# EAGLE design SenseSing-prog-adaptor-v0.2 (EAGLE 6.4)
REVISION: V0.2
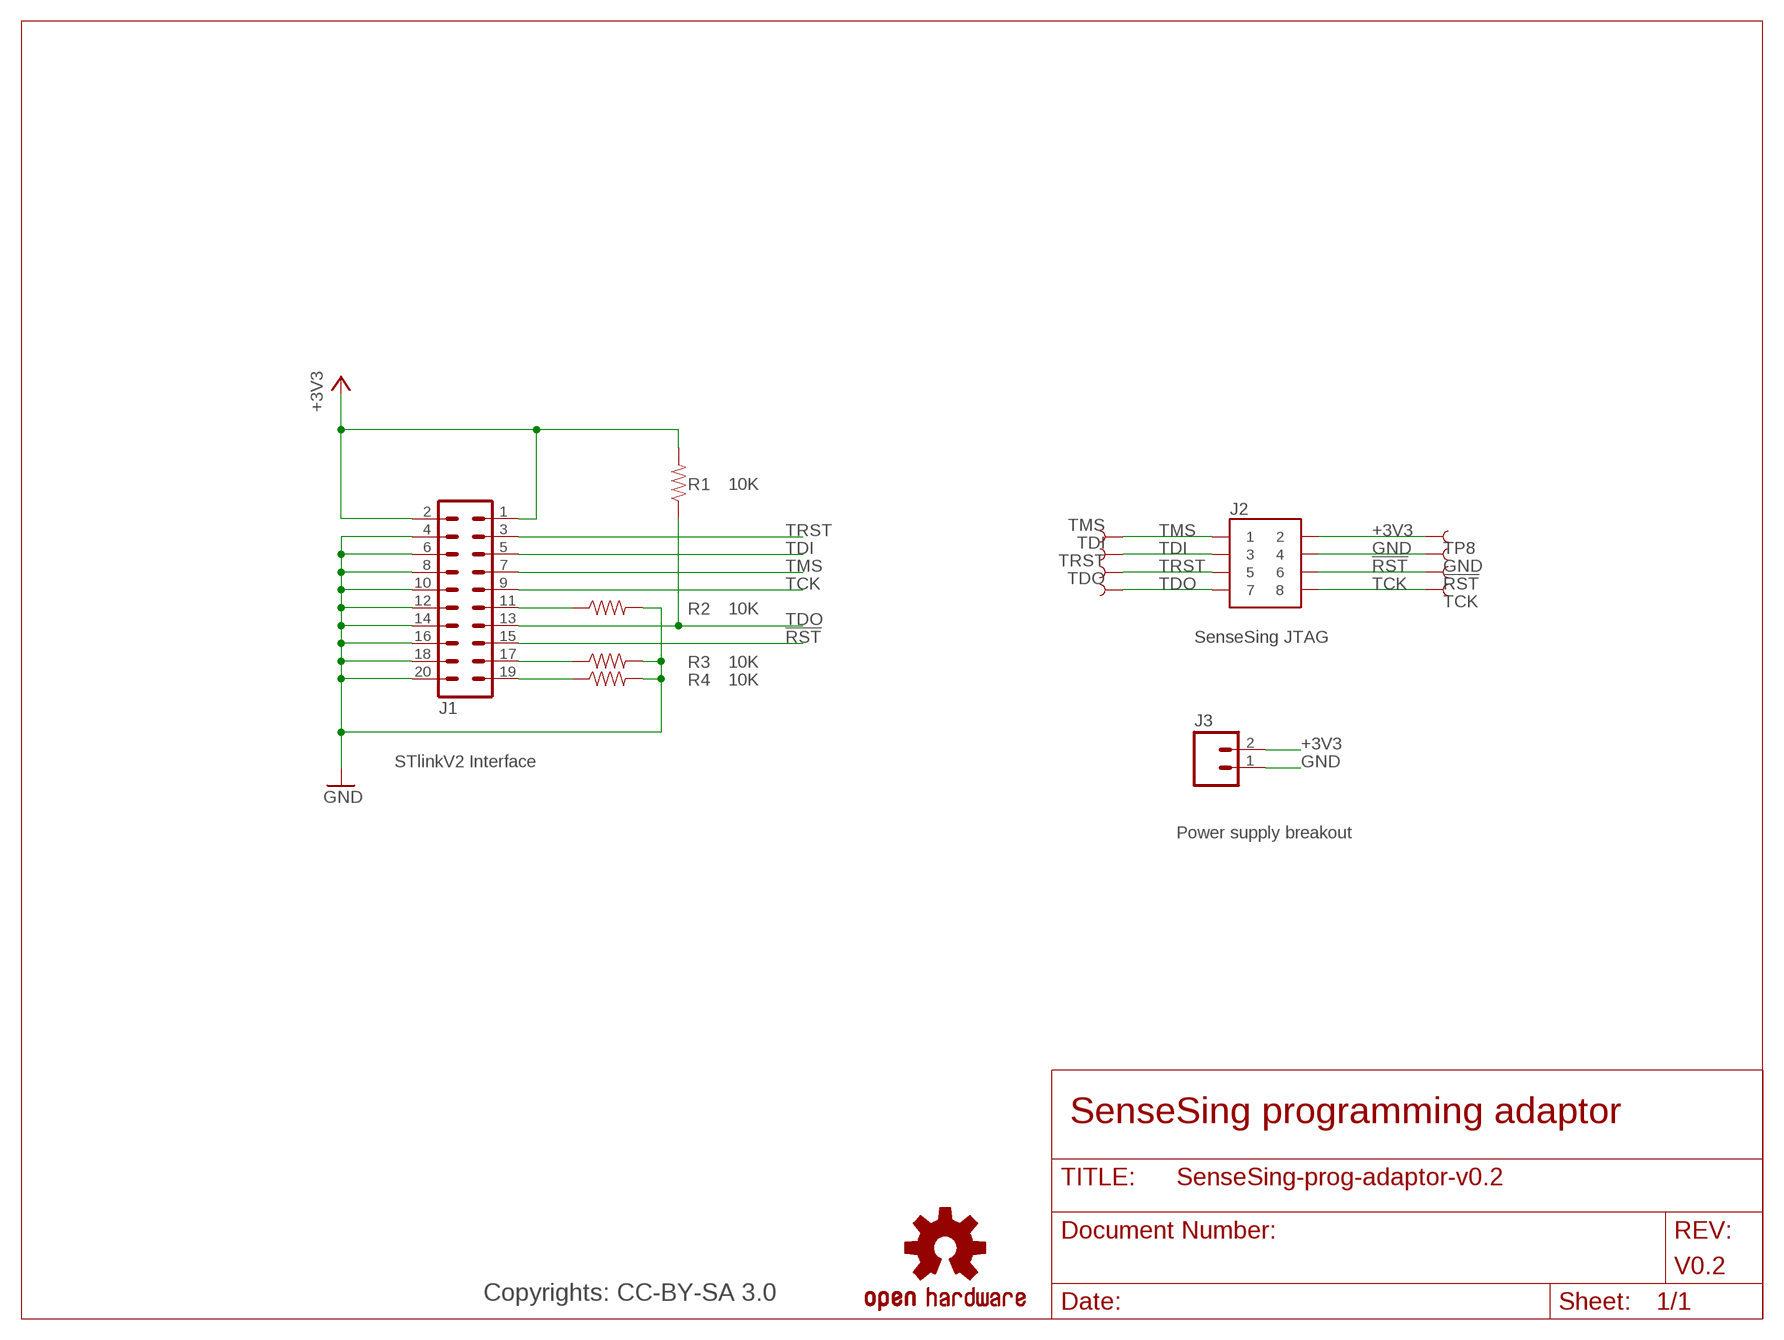
[diagram p0: schematic, sheet 1]

## Parts
!RST  TEST-POINT3  [PAD.03X.03]
GND  TEST-POINT3  [PAD.03X.03]
J1  ML20  [ML20]
J2  JTAG_CONNECTOR  [JTAG_DIP]
J3  M02PTH  [1X02]
LOGO1  OSHW-LOGOPAD  [OSHW-LOGO-M-PAD]
R1  10K  RESISTORAXIAL-0.3  [AXIAL-0.3]
R2  10K  RESISTORAXIAL-0.3  [AXIAL-0.3]
R3  10K  RESISTORAXIAL-0.3  [AXIAL-0.3]
R4  10K  RESISTORAXIAL-0.3  [AXIAL-0.3]
TCK  TEST-POINT3  [PAD.03X.03]
TDI  TEST-POINT3  [PAD.03X.03]
TDO  TEST-POINT3  [PAD.03X.03]
TMS  TEST-POINT3  [PAD.03X.03]
TP8  TEST-POINT3  [PAD.03X.03]
TRST  TEST-POINT3  [PAD.03X.03]

## Nets
!RST: !RST.P$1 J1.15 J2.6
+3V3: J1.1 J1.2 J2.2 J3.2 R1.P$2 TP8.P$1
GND: GND.P$1 J1.4 J1.6 J1.8 J1.10 J1.12 J1.14 J1.16 J1.18 J1.20 J2.4 J3.1 R2.P$2 R3.P$2 R4.P$2
N$13: J1.19 R4.P$1
N$14: J1.17 R3.P$1
N$15: J1.11 R2.P$1
TCK: J1.9 J2.8 TCK.P$1
TDI: J1.5 J2.3 TDI.P$1
TDO: J1.13 J2.7 R1.P$1 TDO.P$1
TMS: J1.7 J2.1 TMS.P$1
TRST: J1.3 J2.5 TRST.P$1

## Notes on the sheet
- SenseSing JTAG
- STlinkV2 Interface
- Power supply breakout
- SenseSing programming adaptor
- Copyrights: CC-BY-SA 3.0

## Library data of the parts
!RST GND TCK TDI TDO TMS TP8 TRST = SparkFun-Passives:TEST-POINT: Bare copper test points for troubleshooting or ICT
J1 = con-harting-ml:ML20: HARTING; OC_FARNELL: unknown; OC_NEWARK: unknown
J2 = JTAG Connector:JTAG_CONNECTOR
J3 = SparkFun-Connectors:M02: Standard 2-pin 0.1" header. Use with - straight break away headers ( PRT-00116) - right angle break away headers (PRT-00553) - swiss pins (PRT-00743) - machine pins (PRT-00117) - female headers (PRT-00115) Molex polarized connector foot print use with: PRT-08233 with associated crimp pins and housings. 2.54_SCREWTERM for use with PRT-10571. 3.5mm Screw Terminal footprints for PRT-08084 5mm Screw Terminal footprints for use with PRT-08432
LOGO1 = kennethlimcp:OSHW-LOGO: Open Source Hardware Logo This logo indicates the piece of hardware it is found on incorporates a OSHW license and/or adheres to the definition of open source hardware found here: http://freedomdefined.org/OSHW
R1-R4 = SparkFun-Passives:RESISTOR: Resistor Basic schematic elements and footprints for 0603, 1206, and PTH resistors.

## Board
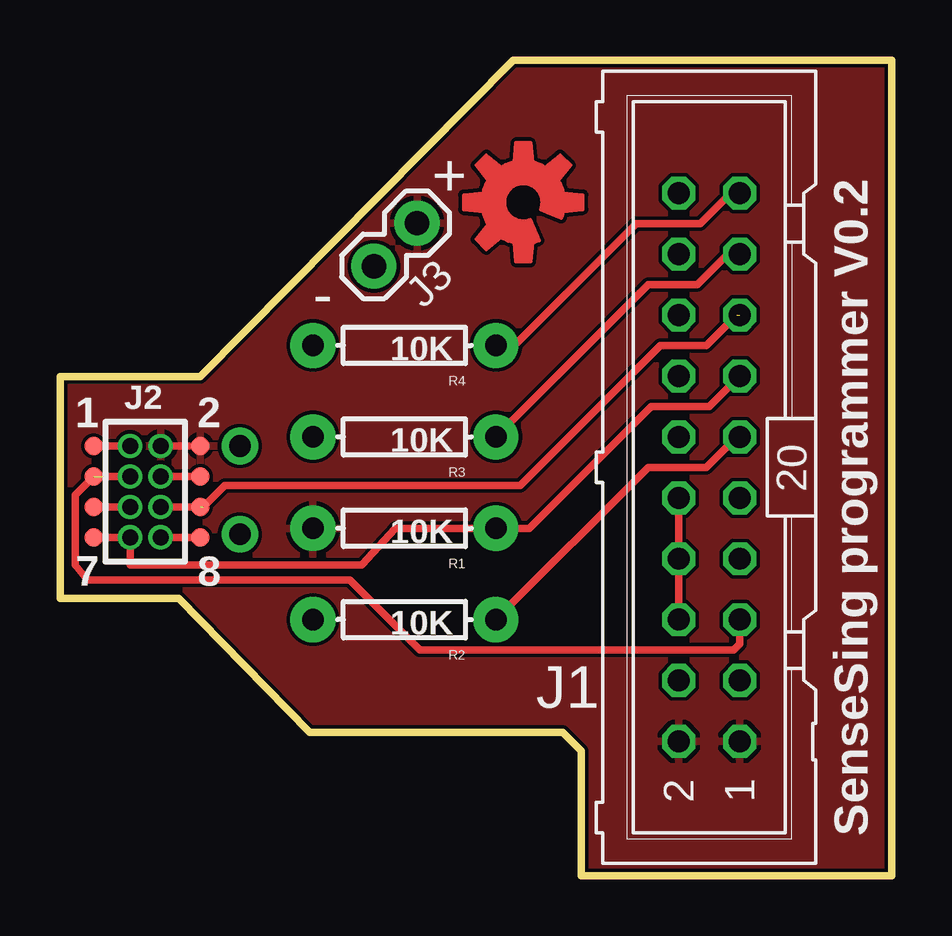
[diagram p1: board, top side]
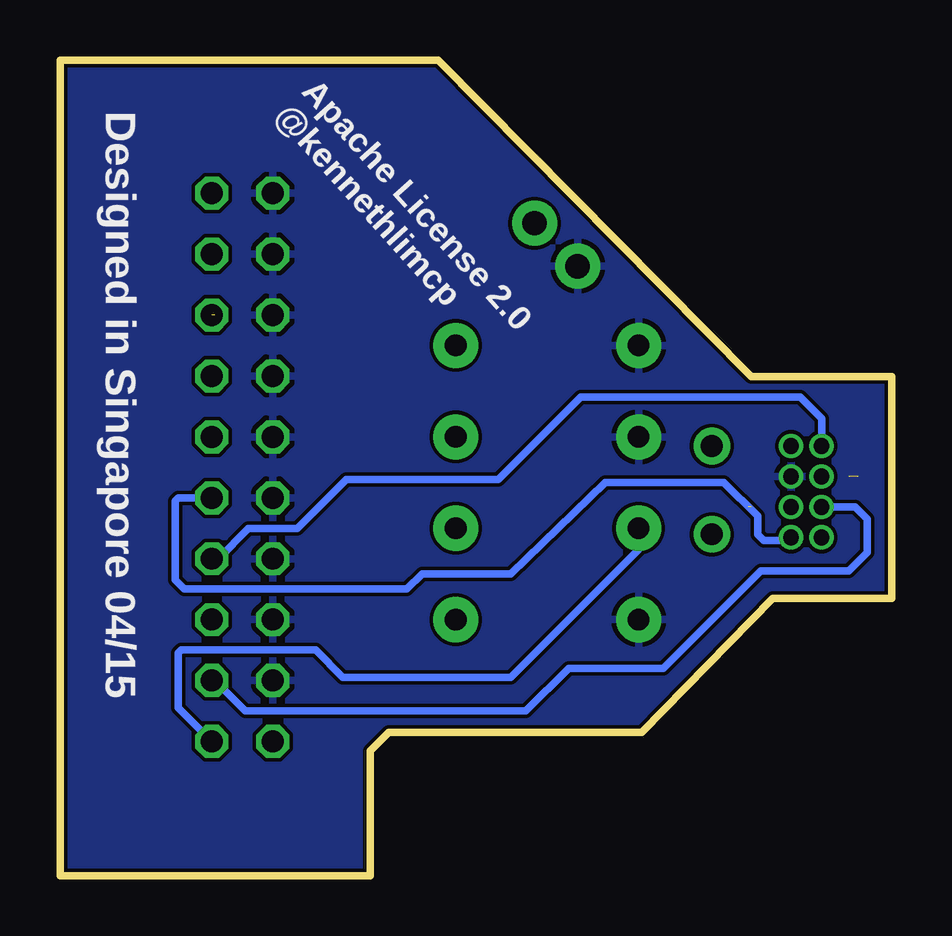
[diagram p2: board, bottom side, seen from below]

Size 34.65 x 34 mm. Coordinates in mm from the lower left corner, seen from the top.
Outline: 21.72,0 21.72,5.21 20.95,5.97 10.41,5.97 4.95,11.56 0,11.56 0,20.79 5.84,20.79 18.89,34 34.65,34 34.65,0 21.72,0
Copper layers (1+2*15+16): Top 0.018mm / dielectric 0.195mm / Route2 0.035mm / dielectric 1.1mm / Route15 0.035mm / dielectric 0.195mm / Bottom 0.018mm
Design rules "spark-4layer *": minimum track width 6mil, minimum drill 0.1mm, track to track 6mil, track to pad 6mil, pad to pad 6mil, via to via 6mil, smd to smd 6mil, copper to edge 6mil, drill to drill 6mil, minimum pad ring 4mil, minimum via ring 4mil, stop-mask expansion 4mil, vias tented up to drill 20mil, thermal gap 8mil

### Footprints (pad centres in the part's own frame; a part is rotated, then mirrored left to right if it is on the bottom)
PAD.03X.03 = smd 0.762 x 0.762: P$1 0,0
ML20 = drill 0.914 octagon: 1 -11.43,-1.27; 2 -11.43,1.27; 3 -8.89,-1.27; 4 -8.89,1.27; 5 -6.35,-1.27; 6 -6.35,1.27; 7 -3.81,-1.27; 8 -3.81,1.27; 9 -1.27,-1.27; 10 -1.27,1.27; 11 1.27,-1.27; 12 1.27,1.27; 13 3.81,-1.27; 14 3.81,1.27; 15 6.35,-1.27; 16 6.35,1.27; 17 8.89,-1.27; 18 8.89,1.27; 19 11.43,-1.27; 20 11.43,1.27
JTAG_DIP = drill 0.66 pad 1.016: 1 0,0; 2 1.27,0; 3 0,-1.27; 4 1.27,-1.27; 5 0,-2.54; 6 1.27,-2.54; 7 0,-3.81; 8 1.27,-3.81
1X02 = drill 1.016 pad 1.88: 1 0,0; 2 2.54,0
AXIAL-0.3 = drill 0.9 pad 1.88: P$1 -3.81,0; P$2 3.81,0

### Placement (x,y rotation side)
!RST  5.84,15.37 0 top
GND  5.84,16.64 0 top
J1  27.05,17.02 90 top
J2  2.92,17.91 0 top
J3  13.08,25.4 45 top
LOGO1  19.3,28.07 45 top
R1  14.35,14.48 180 top
R2  14.35,10.67 180 top
R3  14.35,18.29 180 top
R4  14.35,22.1 180 top
TCK  5.84,14.1 0 top
TDI  1.4,16.64 0 top
TDO  1.4,14.1 0 top
TMS  1.4,17.91 0 top
TP8  5.84,17.91 0 top
TRST  1.4,15.37 0 top

### Tracks (layer width: path | path; a pad name or v marks a point on that pad's centre or on a via)
!RST  (2 unrouted)
  Top 0.305: 28.19,23.37 26.92,22.1 25.02,22.1 19.18,16.26 6.86,16.26 5.97,15.37 J2.6
+3V3
  Top 0.305: J2.2 5.33,17.91
  Bottom 0.305: R1.P$2 10.54,13.59 15.88,8.26 22.86,8.26 24,9.4 29.59,9.4 29.72,9.27 29.72,6.99 J1.1
  pour Top: -0.13,33.91 34.67,33.91 34.67,0.13 -0.25,-0.13
GND
  Top 0.305: J1.10 J1.8 J1.6 | GND.P$1 J2.4
  pour Bottom: -0.38,0 -0.13,33.91 34.67,34.04 34.54,0 -0.38,-0.13
N$1  (via drill 0.9 pad 1.52)
  other vias: 7.49,14.22
N$2  (via drill 0.9 pad 1.52)
  other vias: 7.49,17.91
N$13
  Top 0.305: J1.19 27.94,28.45 26.67,27.18 24,27.18 18.92,22.1 R4.P$1
N$14
  Top 0.305: J1.17 27.81,25.91 26.54,24.64 24.51,24.64 R3.P$1
N$15
  Top 0.305: J1.11 28.19,18.29 26.92,17.02 24.51,17.02 R2.P$1
TCK
  Top 0.305: TCK.P$1 J2.8
  Bottom 0.305: J1.9 29.72,15.75 29.84,15.62 29.84,12.32 29.46,11.94 20.19,11.94 19.56,12.57 15.88,12.57 11.94,16.38 6.98,16.38 5.59,14.99 5.59,14.22 5.33,13.97 4.32,13.97 J2.8
TDI  (1 unrouted)
  Top 0.305: J2.3 1.78,16.64 | J1.5 28.32,9.65 28.07,9.4 14.99,9.4 12.06,12.32 1.14,12.32 0.64,12.95 0.64,15.88 TDI.P$1
TDO
  Top 0.305: J1.13 27.05,19.56 24.64,19.56 19.56,14.48 R1.P$1 13.97,14.48 12.57,12.95 2.92,12.95 J2.7 TDO.P$1
TMS
  Top 0.305: J2.1 TMS.P$1
  Bottom 0.305: J2.1 2.92,19.05 3.81,19.94 12.95,19.94 16.38,16.51 22.73,16.51 24.77,14.48 26.8,14.48 28.07,13.21 J1.7
TRST
  Top 0.305: TRST.P$1 J2.5
  Bottom 0.305: J2.5 1.52,15.37 1.02,14.86 1.02,13.46 1.78,12.7 5.46,12.7 9.53,8.64 13.46,8.64 15.24,6.86 26.92,6.86 28.19,8.13 J1.3

### Text on the board
tNames: + | - | SenseSing programmer V0.2
bNames: Apache License 2.0 / @kennethlimcp | Designed in Singapore 04/15
Design_Info: - Missing TCK route to testpad / - Fixed J2 silkscreen issue / - Improved routing to minimize board width at J2